# EAGLE design photodiode front (EAGLE 8.4.0)
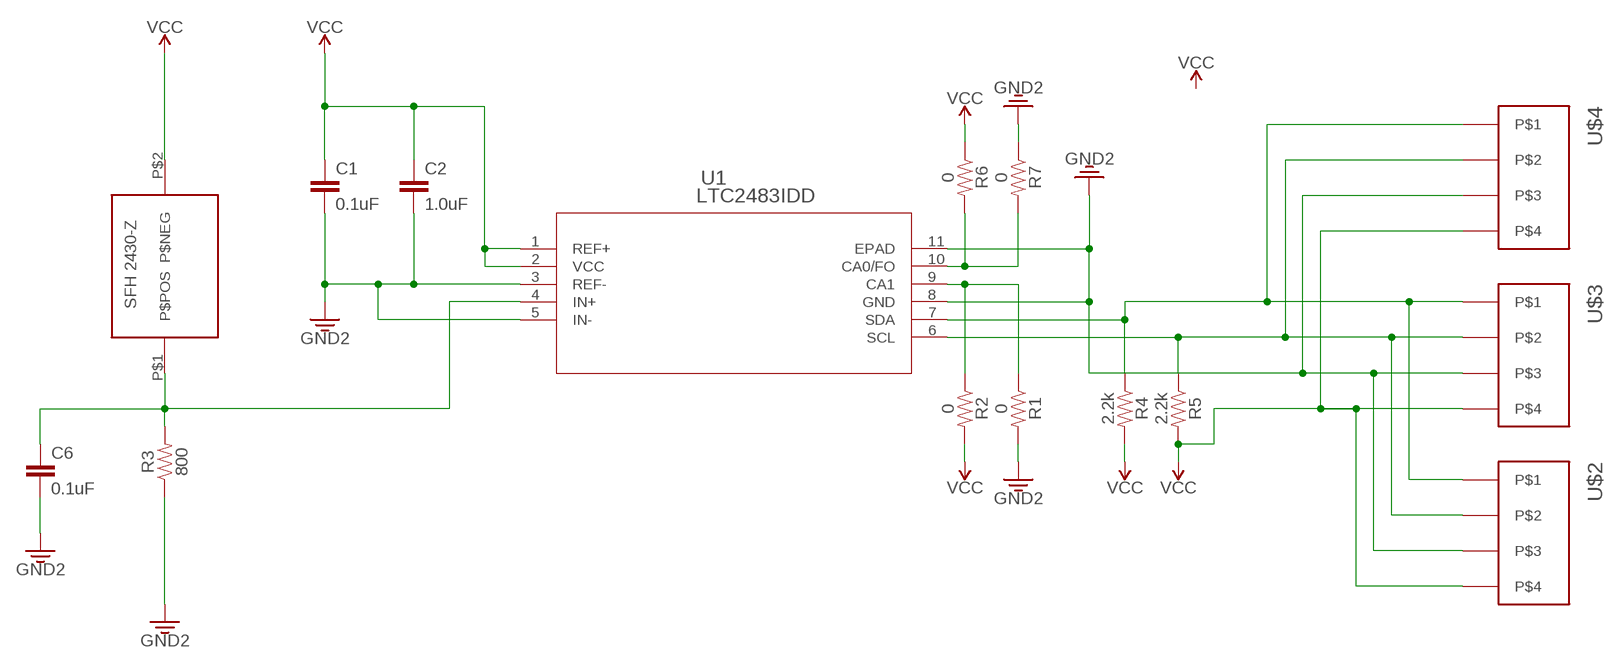
[diagram p0: schematic, sheet 1]

## Parts
C1  0.1uF  10UF-0805-10V-10%  [0805]
C2  1.0uF  10UF-0805-10V-10%  [0805]
C6  0.1uF  10UF-0805-10V-10%  [0805]
R1  0  RESISTOR0805  [0805]
R2  0  RESISTOR0805  [0805]
R3  800  RESISTOR0805  [0805]
R4  2.2k  RESISTOR0805  [0805]
R5  2.2k  RESISTOR0805  [0805]
R6  0  RESISTOR0805  [0805]
R7  0  RESISTOR0805  [0805]
U1  LTC2483IDD  [DFN-10_DD]
U$1  SFH-2430-Z  [DIL]
U$2  PICOLOCK_4PICOLOCK_4  [PICOLOCK_4]
U$3  PICOLOCK_4PICOLOCK_4  [PICOLOCK_4]
U$4  PICOLOCK_4PICOLOCK_4  [PICOLOCK_4]

## Nets
CA0: R6.2 R7.2 U1.10(CA0/FO)
CA1: R1.1 R2.1 U1.9(CA1)
GND: C1.2 C2.2 C6.2 R1.2 R3.1 R7.1 U1.3(REF-) U1.5(IN-) U1.8(GND) U1.11(EPAD) U$2.P$3 U$3.P$3 U$4.P$3 ; supply symbol labelled GND2
OUTPUT: C6.1 R3.2 U1.4(IN+) U$1.P$1(P$POS)
SCL: R5.1 U1.6(SCL) U$2.P$2 U$3.P$2 U$4.P$2
SDA: R4.1 U1.7(SDA) U$2.P$1 U$3.P$1 U$4.P$1
VCC: C1.1 C2.1 R2.2 R4.2 R5.2 R6.1 U1.1(REF+) U1.2(VCC) U$1.P$2(P$NEG) U$2.P$4 U$3.P$4 U$4.P$4

## Library data of the parts
C1 C2 C6 = SparkFun-Capacitors:10UF: 10.0µF ceramic capacitors A capacitor is a passive two-terminal electrical component used to store electrical energy temporarily in an electric field.; PROD_ID: CAP-11330; VALUE: 10uF
R1-R7 = SparkFun-Resistors:RESISTOR: Generic Resistor Package
U1 = LTC2483idd:LTC2483IDD; MANUFACTURER_PART_NUMBER: ltc2483idd; VENDOR: Linear Technology
U$1 = SFH 2430 Z:SFH-2430-Z
U$2-U$4 = DubSat1 Components:PICOLOCK_4

## Net classes
0 default: clearance 0.205 mm

## Board
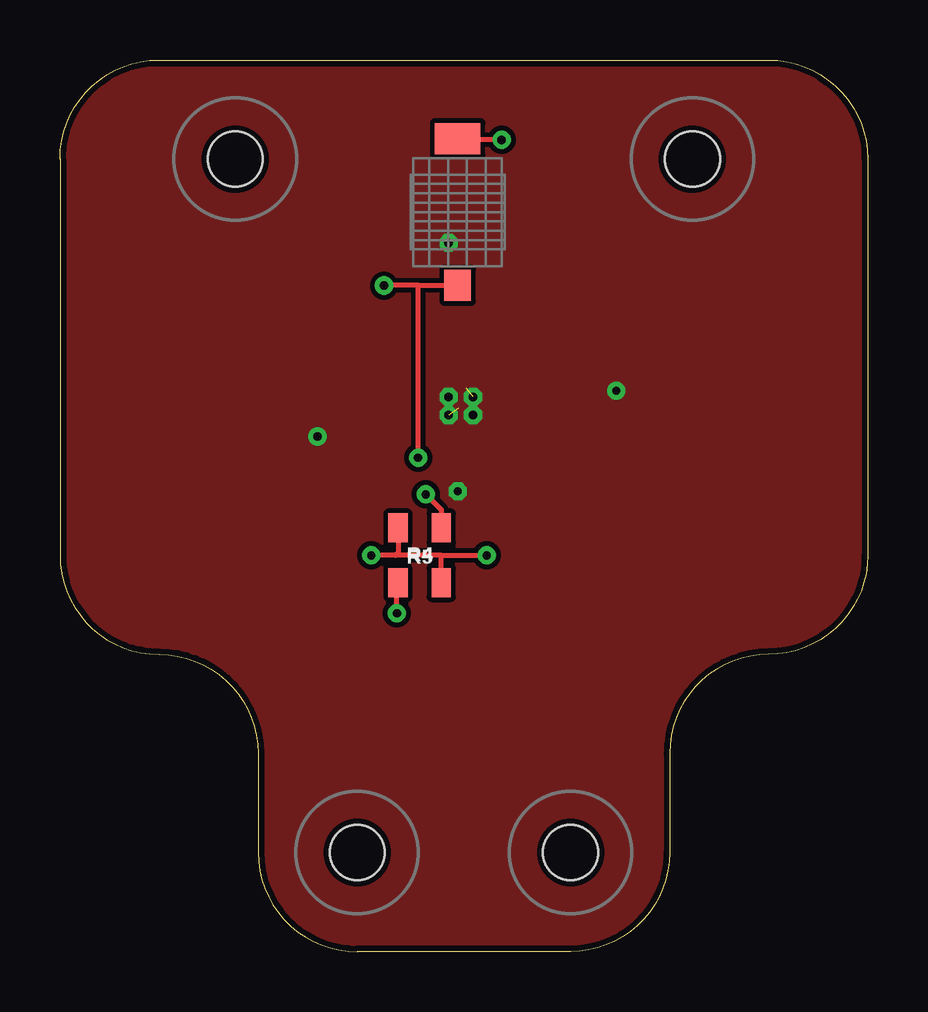
[diagram p1: board, top side]
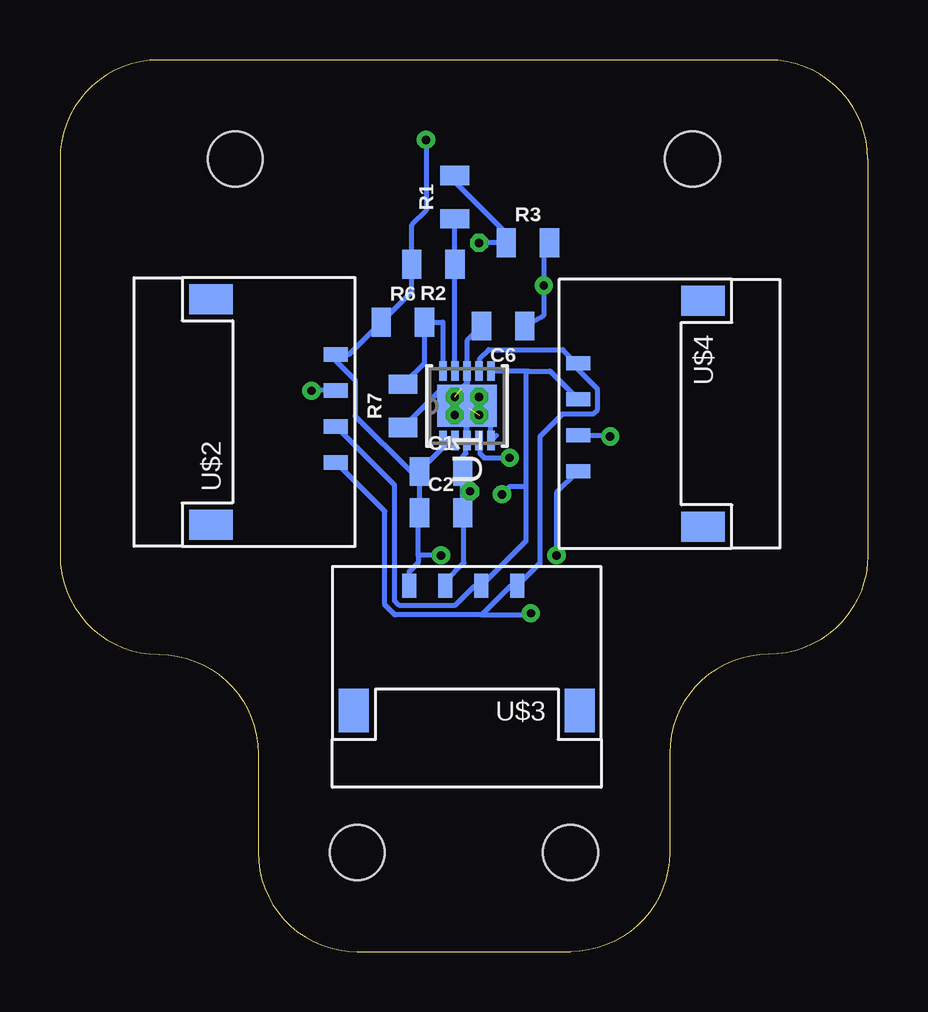
[diagram p2: board, bottom side, seen from below]

Size 33.66 x 37.15 mm. Coordinates in mm from the lower left corner, seen from the top.
Outline: 4.13,37.15 29.53,37.15 arc-90 33.66,33.02 33.66,16.51 arc-90 29.53,12.38 arc90 25.4,8.25 25.4,4.13 arc-90 21.27,0 12.38,0 arc-90 8.25,4.13 8.25,8.25 arc90 4.13,12.38 arc-90 0,16.51 0,33.02 arc-90 4.13,37.15
Copper layers (1*16): Top 0.035mm / dielectric 1.5mm / Bottom 0.035mm
Design rules "default *": minimum track width 6mil, minimum drill 0.35mm, track to track 8mil, track to pad 8mil, pad to pad 8mil, via to via 8mil, smd to smd 8mil, copper to edge 10mil, drill to drill 6mil, minimum pad ring 10mil, minimum via ring 8mil, stop-mask expansion 4mil, vias tented up to drill 0mil, thermal gap 10mil
Holes 2.29 mm at 12.38,4.13 21.27,4.13 26.35,33.02 7.3,33.02

### Footprints (pad centres in the part's own frame; a part is rotated, then mirrored left to right if it is on the bottom)
0805 = smd 0.8 x 1.2: 1 -0.9,0; 2 0.9,0
DFN-10_DD = smd 0.813 x 0.305: 1 -1.448,1; 2 -1.448,0.5; 3 -1.448,0; 4 -1.448,-0.5; 5 -1.448,-1; 6 1.448,-1; 7 1.448,-0.5; 8 1.448,0; 9 1.448,0.5; 10 1.448,1 | smd 1.753 x 2.489: 11 0,0
DIL = smd 1.3 x 1.1: P$1 -0.165,-0.055 | smd 1.3 x 1.9: P$2 5.935,-0.055
PICOLOCK_4 = smd 1.25 x 1.8: MNT@1 -2.605,5.2; MNT@2 6.805,5.2 | smd 0.6 x 1: P$1 0,0; P$2 1.5,0; P$3 3,0; P$4 4.5,0

### Placement (x,y rotation side)
C1  17.78,20 0 bottom
C2  17.78,18.29 0 bottom
C6  15.19,26.06 180 bottom
R1  17.21,31.43 90 bottom
R2  18.1,28.64 180 bottom
R3  14.16,29.53 0 bottom
R4  14.99,15.37 0 top
R5  14.99,17.65 180 top
R6  19.37,26.23 0 bottom
R7  19.37,22.73 90 bottom
U1  16.7,22.73 90 bottom
U$1  16.51,27.93 90 top
U$2  22.16,20.38 90 bottom
U$3  14.61,15.24 180 bottom
U$4  12.06,24.51 270 bottom

### Tracks (layer width: path | path; a pad name or v marks a point on that pad's centre or on a via)
CA0
  Bottom 0.203: U1.10 17.7,26.23 R6.2 18.47,24.53 R7.2
CA1
  Bottom 0.203: U1.9 17.21,27.63 R2.1 17.2,30.52 R1.1
  Bottom 0.254: U1.9
GND  (via drill 0.35)  (2 unrouted)
  Bottom 0.203: 16.6,22.63 U1.11 15.81,22.73 15.7,22.62 U1.5 15.47,21.51 | R1.2 17.21,32.07 15.06,29.92 R3.1 v16.19,29.53 | 16.74,23.65 16.92,23.47 17.73,23.47 R7.1 | U1.3 16.74,21.24 16.74,20.75 16.88,20.61 C1.2 C2.2 16.83,18.24 16.83,16.19 17.61,15.41 U$3.P$3 | C6.2 16.7,25.45 U1.8 | U$4.P$3 10.78,21.51 v10.73,21.46 | U$2.P$3 23.16,23.38 v23.18,23.37
  Bottom 0.254: U1.8 U1.11 | U1.3 16.7,22.53 16.6,22.63
  other vias: 16.19,22.35 16.19,23.11 17.21,23.11 17.21,22.35 16.57,19.18
  pour Top (rank 4): -3.49,-0.32 35.88,-0.32 36.2,38.73 -3.18,39.37
OUTPUT  (via drill 0.35)
  Top 0.203: 14.92,27.76 U$1.P$1 | 14.92,27.76 13.51,27.76 v13.5,27.75 | v14.92,20.57 14.92,27.76
  Bottom 0.203: R3.2 13.5,29.29 v13.5,27.75 13.5,26.49 C6.1 | U1.4 16.16,21.24 16.16,20.75 15.98,20.57 15.42,20.57 v14.92,20.57
SCL  (via drill 0.35)
  Top 0.203: v15.24,19.05 15.89,18.4 R5.1
  Bottom 0.203: 14.16,24.18 13.23,24.18 U$4.P$2 | 14.16,24.18 U1.6 | 14.24,19.37 14.24,17.11 U$3.P$2 16.37,15.24 17.18,14.43 19.53,14.43 19.71,14.61 19.71,19.43 U$2.P$2 | 14.24,19.37 14.24,24.1 14.16,24.18 | 14.24,19.37 14.92,19.37 v15.24,19.05
SDA  (via drill 0.35)
  Top 0.203: v14.03,14.1 14.03,15.31 R4.1
  Bottom 0.203: 12.06,24.45 U$4.P$1 | 12.06,24.45 12.06,24.25 11.26,23.44 11.26,22.58 11.44,22.4 12.71,22.4 13.65,21.46 13.65,16.19 U$3.P$1 14.87,15.24 16.09,14.02 | 16.09,14.02 19.7,14.02 20.12,14.44 20.12,18.34 U$2.P$1 | 16.09,14.02 14.11,14.02 v14.03,14.1 | U1.7 16.16,24.22 16.16,24.71 15.79,25.08 12.7,25.08 12.06,24.45
VCC  (via drill 0.35)
  Top 0.203: v18.4,33.82 15.96,33.82 U$1.P$2 | 13.97,16.51 v12.97,16.51 | 15.88,16.51 13.97,16.51 | 15.88,16.51 v17.78,16.51 | R5.2 14.09,16.63 13.97,16.51 | R4.2 15.89,16.5 15.88,16.51
  Bottom 0.203: v18.4,33.82 18.4,30.87 19,30.28 R2.2 19,27.5 R6.1 21.61,24.88 U$2.P$4 22.16,24.62 21.35,23.81 21.35,22.31 19.05,20 C1.1 | 18.68,18.42 C2.1 | C1.1 18.68,18.42 | C1.1 17.7,20.98 U1.1 | U$3.P$4 19.11,15.82 18.73,16.19 18.73,16.51 | 18.73,16.51 18.73,18.36 18.68,18.42 | U$4.P$4 12.97,19.11 v12.97,16.51 | v17.78,16.51 18.73,16.51
  Bottom 0.305: U1.1 U1.2